# EasyEDA Pro project ProPrj_立创开发板3.1寸MIPI屏幕扩展板.epro

# Schematic 原理图

## Sheets
1 P1: Board Name: Board1; Create Date: 2024-09-23; Page Name: P1; Project Name: 立创开发板3.1寸屏幕扩展板V0.0.2; Schematic Name: Schematic1; Update Date: 2024-09-23
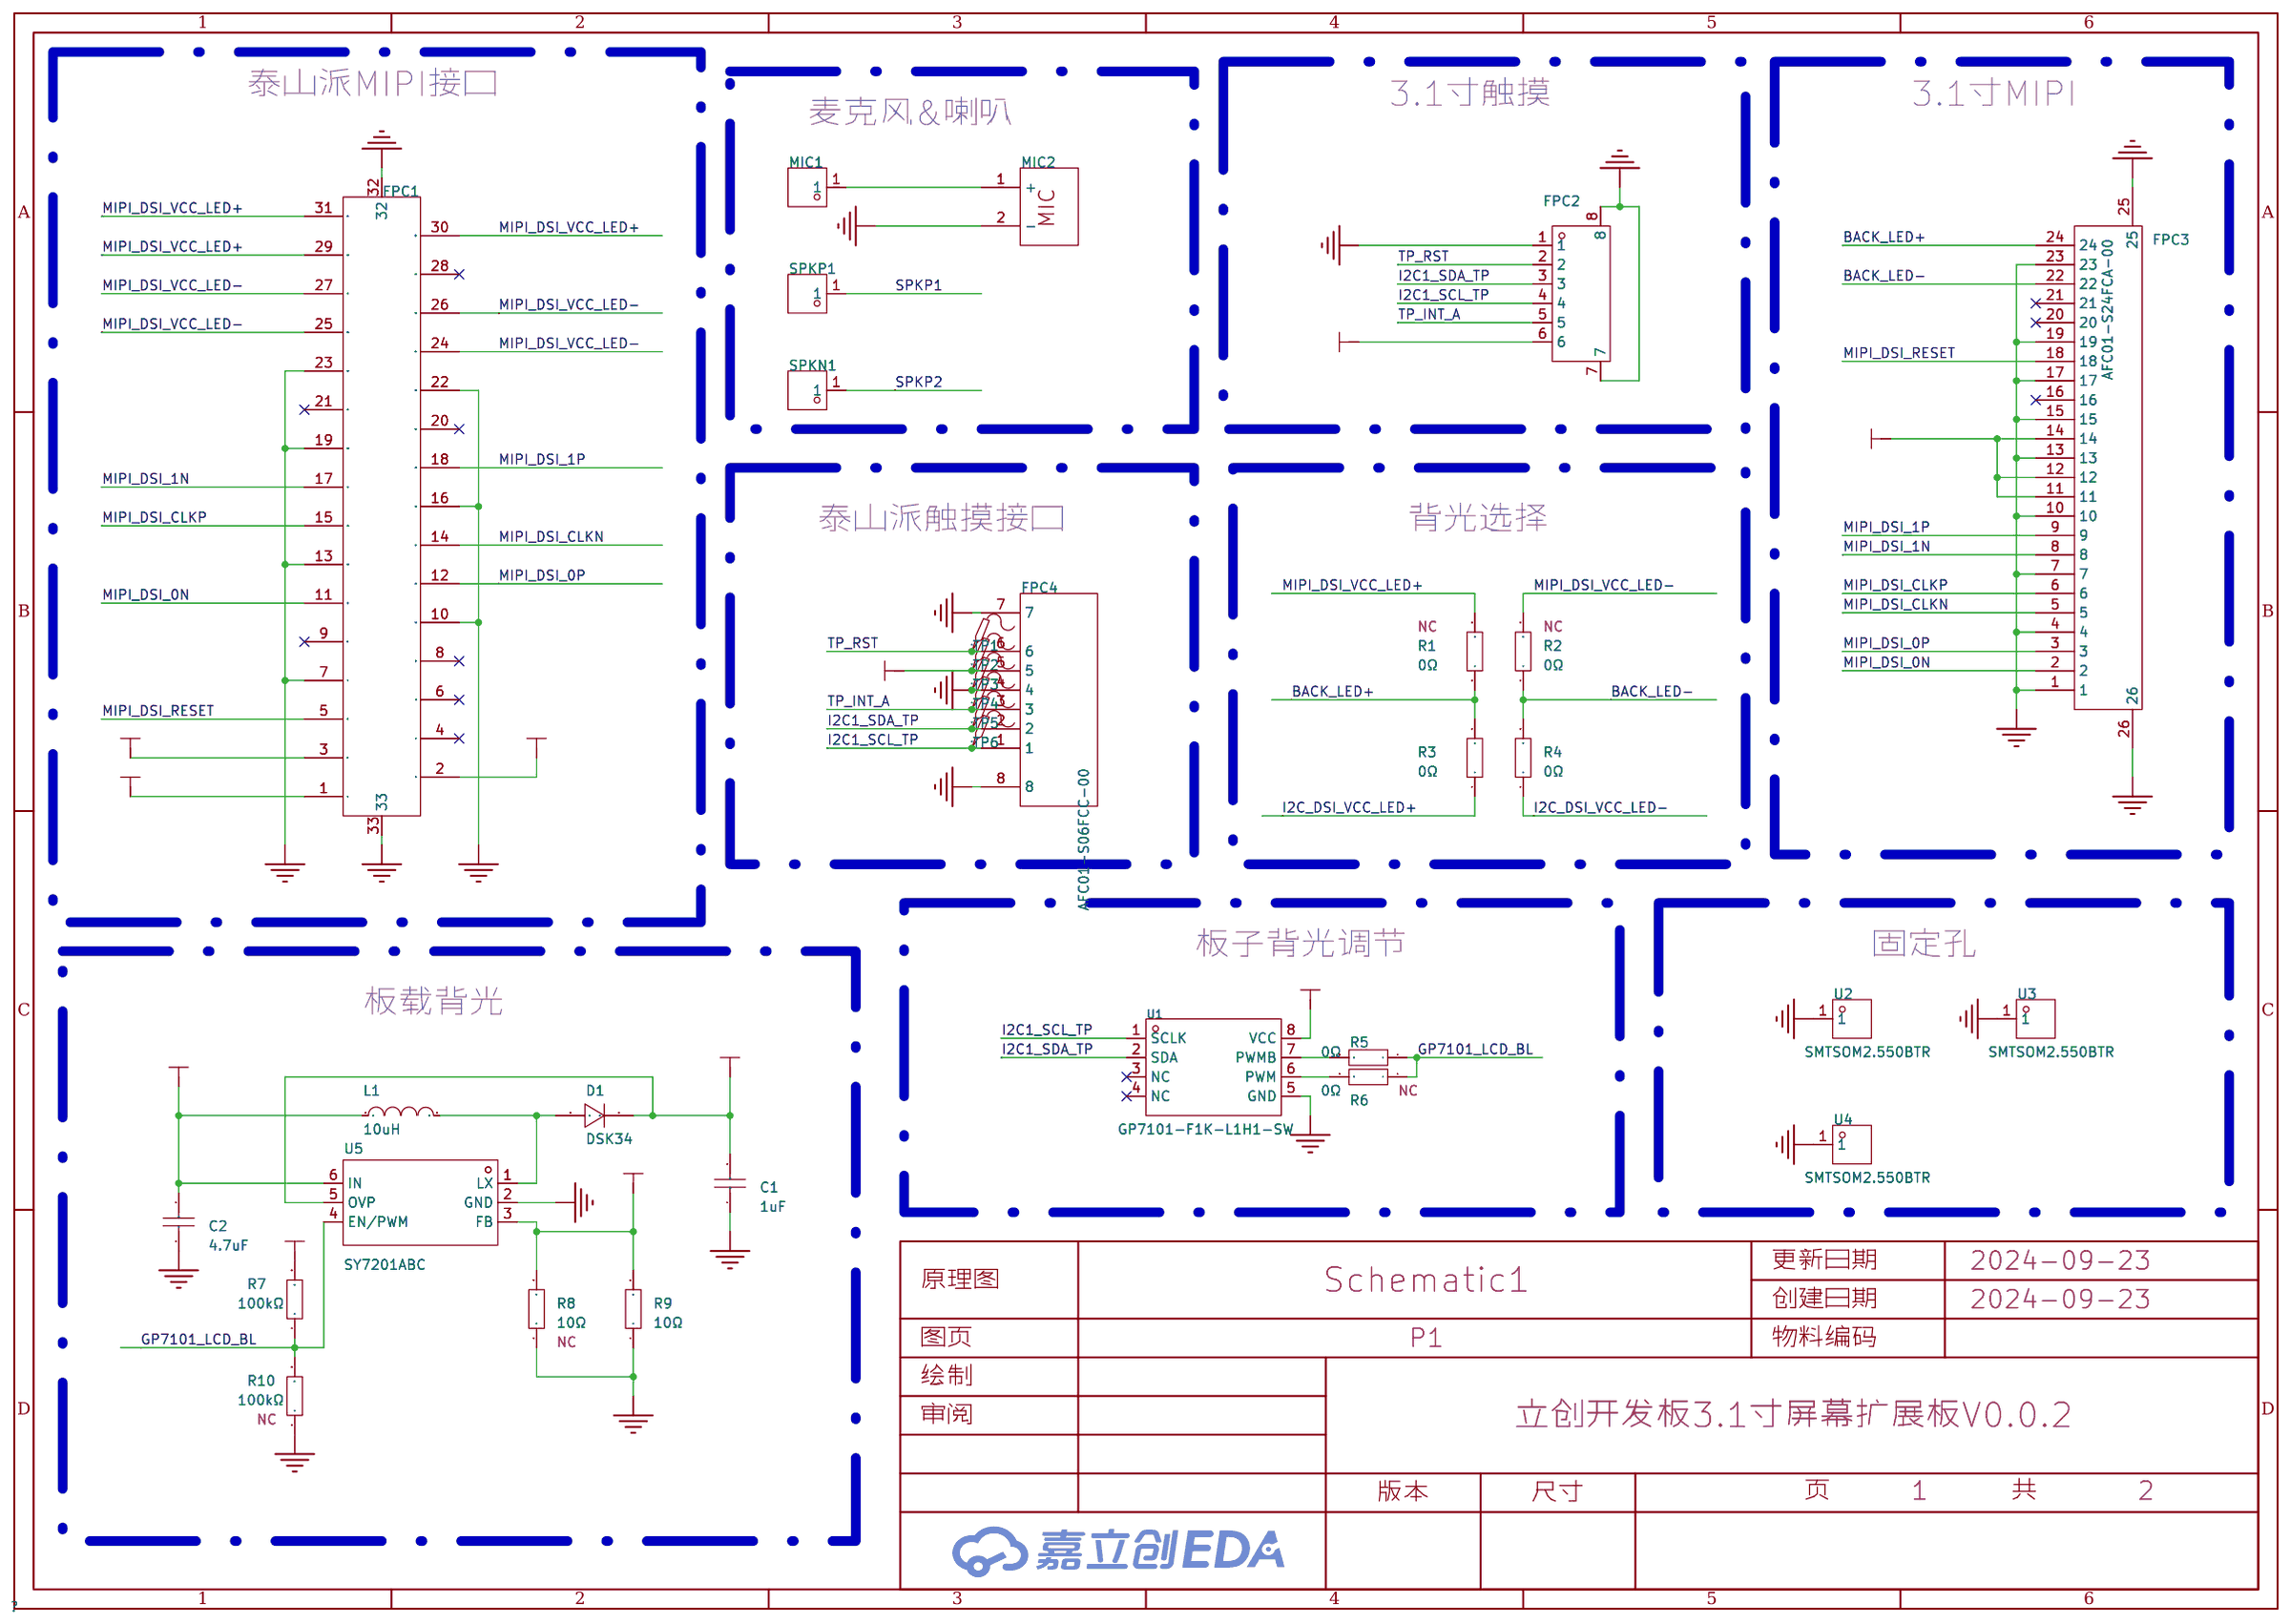
[diagram p0: P1]
2 P2: Create Date: 2024-09-14; Page Name: P2; Project Name: 立创开发板3.1寸屏幕扩展板; Update Date: 2024-09-19
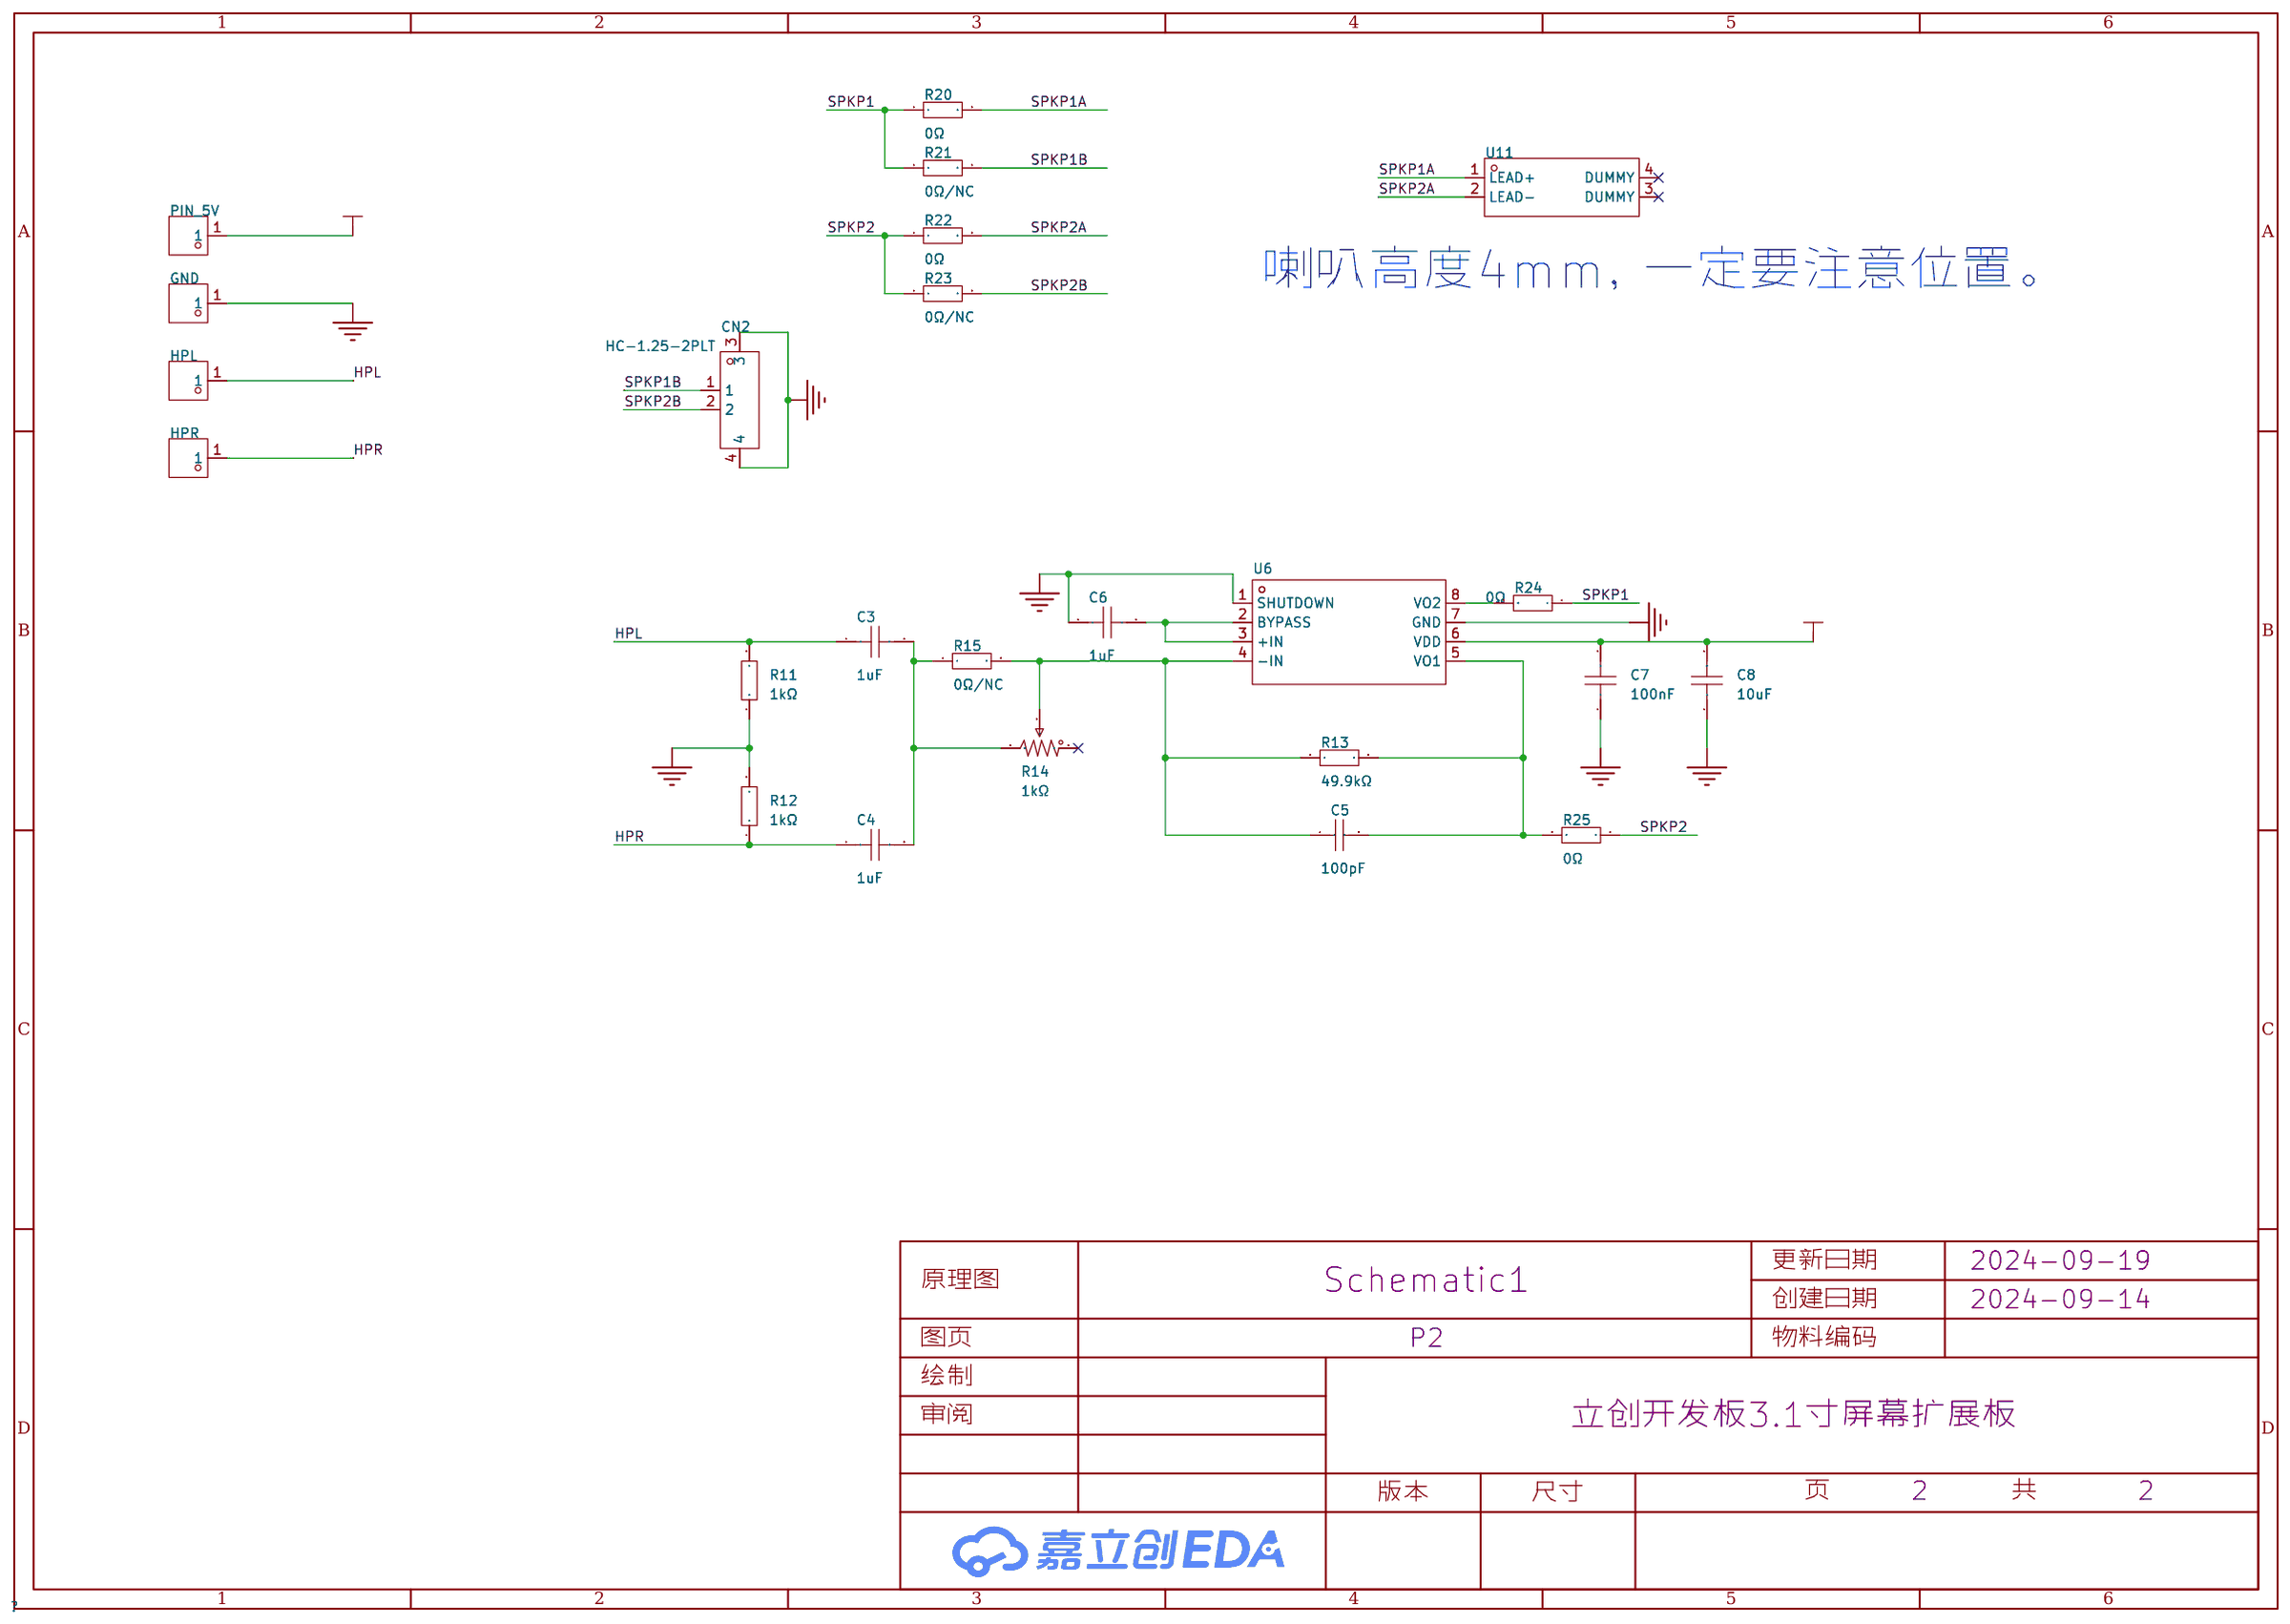
[diagram p1: P2]

## Parts
sheet P1
C1  1uF  [R0805]
C2  4.7uF  [R0805]
D1  DSK34  [SOD-123FL_L2.7-W1.8-LS3.8-RD]
FPC1  AFE03-S31FMA-1H  [FPC-SMD_P0.30-31P_FGS-XJ-H1.0]
FPC2  FPC-05F-6PH20  [FPC-SMD_6P-P0.50_XUNPU_FPC-05F-6PH20]
FPC3  AFC01-S24FCA-00  [FPC-SMD_P0.50-24P_FGS-XJ-H2.0]
FPC4  AFC01-S06FCC-00  [FPC-SMD_AFC01-S06FCC-00]
L1  10uH  [IND-SMD_L2.5-W2.0_WPN252012H]
MIC1  YTC1P-3010-01  [TESTPOINT-SMD_BD2.0_C9900030651]
MIC2  B4013AM423-008  [MIC-SMD_BD4.0_B4013AM423-008]
R1  0Ω  [R0805]
R2  0Ω  [R0805]
R3  0Ω  [R0805]
R4  0Ω  [R0805]
R5  0Ω  [R0805]
R6  0Ω  [R0805]
R7  100kΩ  [R0805]
R8  10Ω  [R0805_NEW]
R9  10Ω  [R0805_NEW]
R10  100kΩ  [R0805]
SPKN1  YTC1P-3010-01  [TESTPOINT-SMD_BD2.0_C9900030651]
SPKP1  YTC1P-3010-01  [TESTPOINT-SMD_BD2.0_C9900030651]
TP1  -  [Test-Point-0.5mm]
TP2  -  [Test-Point-0.5mm]
TP3  -  [Test-Point-0.5mm]
TP4  -  [Test-Point-0.5mm]
TP5  -  [Test-Point-0.5mm]
TP6  -  [Test-Point-0.5mm]
U1  GP7101-F1K-L1H1-SW  [SOIC-8_L4.9-W3.9-P1.27-LS6.0-BL]
U2  SMTSOM2.550BTR  [SMD_BD5.6-D4.1]
U3  SMTSOM2.550BTR  [SMD_BD5.6-D4.1]
U4  SMTSOM2.550BTR  [SMD_BD5.6-D4.1]
U5  SY7201ABC  [SOT-23-6_L2.9-W1.6-P0.95-LS2.8-BR]
sheet P2
C3  1uF  [C0603]
C4  1uF  [C0603]
C5  100pF  [C0603]
C6  1uF  [C0603]
C7  100nF  [C0603]
C8  10uF  [C0603]
CN2  HC-1.25-2PLT  [CONN-SMD_HC-1.25-2PLT]
GND  YTC1P-3010-01  [TESTPOINT-SMD_BD2.0_C9900030651]
HPL  YTC1P-3010-01  [TESTPOINT-SMD_BD2.0_C9900030651]
HPR  YTC1P-3010-01  [TESTPOINT-SMD_BD2.0_C9900030651]
PIN_5V  YTC1P-3010-01  [TESTPOINT-SMD_BD2.0_C9900030651]
R11  1kΩ  [R0603]
R12  1kΩ  [R0603]
R13  49.9kΩ  [R0603]
R14  1kΩ  [RES-ADJ-SMD_3P-L3.8-W3.6-P1.90-BL]
R15  0Ω/NC  [R0603]
R20  0Ω  [R0603]
R21  0Ω/NC  [R0603]
R22  0Ω  [R0603]
R23  0Ω/NC  [R0603]
R24  0Ω  [R0805]
R25  0Ω  [R0805]
U6  SC8002B  [SOP-8_L4.9-W3.9-P1.27-LS6.0-BL]
U11  KLJ-01304T-08R07W  [BUZ-SMD_4P-L13.0-W13.0-P11.4-BL]

## Library data of the parts
C1 = CL21B105KBFNNNE: 容值:1uF;精度:±10%;额定电压:50V;材质(温度系数):X7R;; LCSC Part Name: 1uF ±10% 50V; Supplier Part: C28323; Manufacturer: SAMSUNG(三星); Supplier Footprint: 0805; JLCPCB Part Class: 基础库; Datasheet: https://atta.szlcsc.com/upload/public/pdf/source/20160218/1457707763339.pdf; Supplier: LCSC; Tolerance: ±10%; Voltage Rated: 50V; Temperature Coefficient: X7R
C2 = CL21A475KAQNNNE: 容值:4.7uF;精度:±10%;额定电压:25V;材质(温度系数):X5R;; LCSC Part Name: 4.7uF ±10% 25V; Supplier Part: C1779; Manufacturer: SAMSUNG(三星); Supplier Footprint: 0805; JLCPCB Part Class: 基础库; Datasheet: https://atta.szlcsc.com/upload/public/pdf/source/20160218/1457707763339.pdf; Supplier: LCSC; Tolerance: ±10%; Voltage Rated: 25V; Temperature Coefficient: X5R
D1 = DSK34_C727076: 二极管配置:-;直流反向耐压(Vr):1kV;平均整流电流(Io):1A;正向压降(Vf):1.1V@1A;反向电流(Ir):10uA@1kV;; Supplier Part: C727076; Manufacturer: TWGMC(台湾迪嘉); Supplier Footprint: SOD-123FL; JLCPCB Part Class: Extended Part; Datasheet: https://atta.szlcsc.com/upload/public/pdf/source/20200828/C727076_B37FCA1E25E95F22A97D5A5D18D72E25.pdf; Supplier: LCSC; Reverse Voltage (Vr): 1kV; Average Rectified Current (Io): 1A; Forward Voltage (Vf@If): 1.1V@1A; Reverse Leakage Current: 10uA@1kV
FPC1 = AFE03-S31FMA-1H: 间距:0.3mm;触点数量:31;锁定特性:翻盖式;安装类型:卧贴;触点类型:下接;; LCSC Part Name: FPC 0.3 MM 31P 翻盖式 H1.0mm 下接; Supplier Part: C262545; Manufacturer: JS(钜硕电子); Supplier Footprint: P=0.3mm; JLCPCB Part Class: Extended Part; Datasheet: https://atta.szlcsc.com/upload/public/pdf/source/20180810/C262545_77B457498850318D655D6A9CA7AC22AD.pdf; Supplier: LCSC; Locking Feature: 翻盖式; Contact Type: 下接; Number of Contacts: 31; Pitch: 0.3mm; Mounting Type: 卧贴; FFC, FCB Thickness: 0.2mm~0.2mm; Height Above Board: 1mm
FPC2 = FPC-05F-6PH20: 间距:0.5mm;触点数量:6P;锁定特性:翻盖式;触点类型:下接;安装类型:卧贴;工作温度范围:-25℃~+85℃;; LCSC Part Name: 间距:0.5mm P数:6P 翻盖式 下接; Supplier Part: C2856796; Manufacturer: XUNPU(讯普); Supplier Footprint: SMD,P=0.5mm,卧贴; JLCPCB Part Class: 扩展库; Datasheet: https://atta.szlcsc.com/upload/public/pdf/source/20210922/16B003FB53336DDF6538142CC465AC4D.pdf; Supplier: LCSC; Pitch: 0.5mm; Number of Contacts: 6P; Locking Feature: 翻盖式; FFC, FCB Thickness: 0.3mm; Contact Type: 下接; Mounting Type: 卧贴; Height Above Board: 2mm; Operating Temperature Range: -25℃~+85℃
FPC3 = AFC01-S24FCA-00: 间距:0.5mm;触点数量:24P;锁定特性:翻盖式;触点类型:下接;安装类型:卧贴;; LCSC Part Name: 间距:0.5mm P数:24P 翻盖式 下接; Supplier Part: C262669; Manufacturer: JS(钜硕电子); Supplier Footprint: SMD,P=0.5mm,卧贴; JLCPCB Part Class: 扩展库; Datasheet: https://atta.szlcsc.com/upload/public/pdf/source/20190816/C413942_2A72D1AC756EAE17EEDF756A339D4500.pdf; Supplier: LCSC; Pitch: 0.5mm; Number of Contacts: 24P; Locking Feature: 翻盖式; FFC, FCB Thickness: 0.3mm; Contact Type: 下接; Mounting Type: 卧贴; Height Above Board: 2mm
FPC4 = AFC01-S06FCC-00: 间距:0.5mm;触点数量:6;锁定特性:翻盖式;安装类型:卧贴;触点类型:下接;; LCSC Part Name: 0.5mm翻盖6P; Supplier Part: C262262; Manufacturer: JS(钜硕电子); Supplier Footprint: P=0.5mm; JLCPCB Part Class: Extended Part; Datasheet: https://atta.szlcsc.com/upload/public/pdf/source/20180810/C262262_206E24848442025CB909F073CC69569A.pdf; Supplier: LCSC; Pitch: 0.5mm; Number of Contacts: 6; Locking Feature: 翻盖式; Mounting Type: 卧贴; Contact Type: 下接; Height Above Board: 2mm; FFC, FCB Thickness: 0.3mm~0.3mm
L1 = WPN252012H100MT: 电感值:10uH;精度:±20%;额定电流:850mA;直流电阻(DCR):480mΩ;; LCSC Part Name: 10uH ±20% 850mA 480mΩ; Supplier Part: C98353; Manufacturer: Sunlord(顺络); Supplier Footprint: SMD; JLCPCB Part Class: Extended Part; Datasheet: https://atta.szlcsc.com/upload/public/pdf/source/20210916/5D33DED32780FEB7D0AA8BED8FC93477.pdf; Supplier: LCSC; Tolerance: ±20%; Rated Current: 850mA; DC Resistance (DCR): 480mΩ; Saturation Current (Isat): 110mA; Frequency - Self Resonant: 2MHz
GND HPL HPR MIC1 PIN_5V SPKN1 SPKP1 = YTC1P-3010-01: 类型:弹簧顶针(POGO PIN);PIN位数:单PIN位;全长/全高:4mm;额定电流:2.5A;额定电压:12V;触头材质:黄铜;触头镀层:金;; LCSC Part Name: POGO PIN弹簧顶针 贴片连接器; Supplier Part: C5221282; Manufacturer: YIYUAN(怡远); JLCPCB Part Class: 扩展库; Datasheet: https://atta.szlcsc.com/upload/public/pdf/source/20221031/BD070516233C1C93A35D01CFB419D0D5.pdf; Supplier: LCSC; Type: 弹簧顶针(POGO PIN); Number of Pins: 单PIN位; Overall Length/Height: 4mm; Rated Current: 2.5A; Rated Voltage: 12V; Contact Material: 黄铜; Contact Plating: 金
MIC2 = B4013AM423-008: LCSC Part Name: 驻极体电容φ4.0*1.3mm 1.0V-10V 灵敏度-42dB; Supplier Part: C233794; Manufacturer: Goertek(歌尔); JLCPCB Part Class: 扩展库; Datasheet: https://atta.szlcsc.com/upload/public/pdf/source/20180813/C233794_264218F4B1A78DA959E94BA30E23E4FF.pdf; Supplier: LCSC
R1 R2 R6 = 0805W8F0000T5E: 电阻类型:厚膜电阻;阻值:0Ω;精度:±1%;功率:125mW;最大工作电压:150V;温度系数:±800ppm/℃;; LCSC Part Name: 0Ω ±1% 125mW 厚膜电阻; Supplier Part: NC; Manufacturer: UNI-ROYAL(厚声); Supplier Footprint: 0805; JLCPCB Part Class: 基础库; Datasheet: https://atta.szlcsc.com/upload/public/pdf/source/20200306/C422600_1E6D84923E4A46A82E41ADD87F860B5C.pdf; Supplier: LCSC; Type: 厚膜电阻; Tolerance: ±1%; Power(Watts): 125mW; Overload Voltage (Max): 150V; Temperature Coefficient: ±800ppm/℃; Operating Temperature Range: -55℃~+155℃
R3-R5 R24 R25 = 0805W8F0000T5E: 电阻类型:厚膜电阻;阻值:0Ω;精度:±1%;功率:125mW;最大工作电压:150V;温度系数:±800ppm/℃;; LCSC Part Name: 0Ω ±1% 125mW 厚膜电阻; Supplier Part: C17477; Manufacturer: UNI-ROYAL(厚声); Supplier Footprint: 0805; JLCPCB Part Class: 基础库; Datasheet: https://atta.szlcsc.com/upload/public/pdf/source/20200306/C422600_1E6D84923E4A46A82E41ADD87F860B5C.pdf; Supplier: LCSC; Type: 厚膜电阻; Tolerance: ±1%; Power(Watts): 125mW; Overload Voltage (Max): 150V; Temperature Coefficient: ±800ppm/℃; Operating Temperature Range: -55℃~+155℃
R7 = 0805W8F1003T5E: 电阻类型:厚膜电阻;阻值:100kΩ;精度:±1%;功率:125mW;最大工作电压:150V;温度系数:±100ppm/℃;; LCSC Part Name: 100kΩ ±1% 125mW 厚膜电阻; Supplier Part: C149504; Manufacturer: UNI-ROYAL(厚声); Supplier Footprint: 0805; JLCPCB Part Class: 基础库; Datasheet: https://atta.szlcsc.com/upload/public/pdf/source/20200306/C422600_1E6D84923E4A46A82E41ADD87F860B5C.pdf; Supplier: LCSC; Type: 厚膜电阻; Tolerance: ±1%; Power(Watts): 125mW; Overload Voltage (Max): 150V; Temperature Coefficient: ±100ppm/℃; Operating Temperature Range: -55℃~+155℃
R8 = 0805W8F100JT5E: 电阻类型:厚膜电阻;阻值:10Ω;精度:±1%;功率:125mW;最大工作电压:150V;温度系数:±200ppm/℃;; LCSC Part Name: 10Ω ±1% 125mW 厚膜电阻; Supplier Part: NC; Manufacturer: UNI-ROYAL(厚声); Supplier Footprint: 0805; JLCPCB Part Class: 基础库; Datasheet: https://atta.szlcsc.com/upload/public/pdf/source/20200306/C422600_1E6D84923E4A46A82E41ADD87F860B5C.pdf; Supplier: LCSC; Type: 厚膜电阻; Tolerance: ±1%; Power(Watts): 125mW; Overload Voltage (Max): 150V; Temperature Coefficient: ±200ppm/℃; Operating Temperature Range: -55℃~+155℃
R9 = 0805W8F100JT5E: 电阻类型:厚膜电阻;阻值:10Ω;精度:±1%;功率:125mW;最大工作电压:150V;温度系数:±200ppm/℃;; LCSC Part Name: 10Ω ±1% 125mW 厚膜电阻; Supplier Part: C17415; Manufacturer: UNI-ROYAL(厚声); Supplier Footprint: 0805; JLCPCB Part Class: 基础库; Datasheet: https://atta.szlcsc.com/upload/public/pdf/source/20200306/C422600_1E6D84923E4A46A82E41ADD87F860B5C.pdf; Supplier: LCSC; Type: 厚膜电阻; Tolerance: ±1%; Power(Watts): 125mW; Overload Voltage (Max): 150V; Temperature Coefficient: ±200ppm/℃; Operating Temperature Range: -55℃~+155℃
R10 = 0805W8F1003T5E: 电阻类型:厚膜电阻;阻值:100kΩ;精度:±1%;功率:125mW;最大工作电压:150V;温度系数:±100ppm/℃;; LCSC Part Name: 100kΩ ±1% 125mW 厚膜电阻; Supplier Part: NC; Manufacturer: UNI-ROYAL(厚声); Supplier Footprint: 0805; JLCPCB Part Class: 基础库; Datasheet: https://atta.szlcsc.com/upload/public/pdf/source/20200306/C422600_1E6D84923E4A46A82E41ADD87F860B5C.pdf; Supplier: LCSC; Type: 厚膜电阻; Tolerance: ±1%; Power(Watts): 125mW; Overload Voltage (Max): 150V; Temperature Coefficient: ±100ppm/℃; Operating Temperature Range: -55℃~+155℃
TP1-TP6 = Test-Point: Test Point 测试点
U1 = GP7101-F1K-L1H1-SW: 数模转换芯片ADC@@通过I2C进行数据输入，线性转换成0%-100%占空比的PWM信号输出; Supplier Part: C7471834; Manufacturer: Guestgood(客益); Supplier Footprint: SOP-8; Datasheet: https://atta.szlcsc.com/upload/public/pdf/source/20231229/76062E2A220BC0161533915FA1180BFB.pdf; Supplier: LCSC
U2-U4 = SMTSOM2.550BTR: M2x4.35xL5+1.4; LCSC Part Name: M2.5 贴片螺母 L=5mm铜镀锡; Supplier Part: C5301778; Manufacturer: YIYUAN(怡远); Supplier Footprint: M2.5; JLCPCB Part Class: Extended Part; Datasheet: https://atta.szlcsc.com/upload/public/pdf/source/20230202/A42D22DA7D93D728E13784C4003E4077.pdf; Supplier: LCSC; specifications: M2.5; surface treatment: 镀锡; material quality: 铜; length: 5mm; model: SMTWE2050MTJ; brand: Sinhoo(雄和远景)
U5 = SY7201ABC: 30V 大电流LED驱动IC; Supplier Part: C82173; Manufacturer: silergy(矽力杰); Supplier Footprint: SOT-23-6; JLCPCB Part Class: Extended Part; Datasheet: https://atta.szlcsc.com/upload/public/pdf/source/20160903/1472896628181.pdf; Supplier: LCSC
C3 C4 C6 = CL10A105KB8NNNC: 容值:1uF;精度:±10%;额定电压:50V;材质(温度系数):X5R;; LCSC Part Name: 1uF ±10% 50V; Supplier Part: C15849; Manufacturer: SAMSUNG(三星); Supplier Footprint: 0603; JLCPCB Part Class: 基础库; Datasheet: https://atta.szlcsc.com/upload/public/pdf/source/20160218/1457707763339.pdf; Supplier: LCSC; Tolerance: ±10%; Voltage Rated: 50V; Temperature Coefficient: X5R
C5 = CL10C101JB8NNNC: 容值:100pF;精度:±5%;额定电压:50V;材质(温度系数):C0G;; LCSC Part Name: 100pF ±5% 50V; Supplier Part: C14858; Manufacturer: SAMSUNG(三星); Supplier Footprint: 0603; JLCPCB Part Class: 基础库; Datasheet: https://atta.szlcsc.com/upload/public/pdf/source/20160218/1457707763339.pdf; Supplier: LCSC; Tolerance: ±5%; Voltage Rated: 50V; Temperature Coefficient: C0G
C7 = CC0603KRX7R9BB104: 容值:100nF;精度:±10%;额定电压:50V;材质(温度系数):X7R;; LCSC Part Name: 100nF ±10% 50V; Supplier Part: C14663; Manufacturer: YAGEO(国巨); Supplier Footprint: 0603; JLCPCB Part Class: 基础库; Datasheet: https://atta.szlcsc.com/upload/public/pdf/source/20180910/C282072_33301C7F631E79921B82A8DAC6BCC5B3.pdf; Supplier: LCSC; Tolerance: ±10%; Voltage Rated: 50V; Temperature Coefficient: X7R
C8 = CL10A106MA8NRNC: 容值:10uF;精度:±20%;额定电压:25V;材质(温度系数):X5R;; LCSC Part Name: 10uF ±20% 25V; Supplier Part: C96446; Manufacturer: SAMSUNG(三星); Supplier Footprint: 0603; JLCPCB Part Class: 基础库; Datasheet: https://atta.szlcsc.com/upload/public/pdf/source/20160218/1457707763339.pdf; Supplier: LCSC; Tolerance: ±20%; Voltage Rated: 25V; Temperature Coefficient: X5R
CN2 = HC-1.25-2PLT: 插针结构:1x2P;间距:1.25mm;安装方式:立贴;参考系列:-;总PIN数:2P;排数:1;每排PIN数:2;行距:-;额定电流:2A;触头材质:黄铜;触头镀层:锡;工作温度范围:-25℃~+85℃;; LCSC Part Name: 1x2P 间距:1.25mm 立贴; Supplier Part: C2845388; Manufacturer: HCTL(华灿天禄); Supplier Footprint: SMD,P=1.25mm; JLCPCB Part Class: 扩展库; Datasheet: https://atta.szlcsc.com/upload/public/pdf/source/20230707/8E5913B5A3195C18F5EE12EA4CB86B82.pdf; Supplier: LCSC; Pins Structure: 1x2P; Pitch: 1.25mm; Mounting Style: 立贴; Number of Pins: 2P; Number of Rows: 1; Number of PINs Per Row: 2; Current Rating (Max): 2A; Contact Material: 黄铜; Contact Plating: 锡; Operating Temperature Range: -25℃~+85℃
R11 R12 = 0603WAF1001T5E: 电阻类型:厚膜电阻;阻值:1kΩ;精度:±1%;功率:100mW;最大工作电压:75V;温度系数:±100ppm/℃;; LCSC Part Name: 1kΩ ±1% 100mW 厚膜电阻; Supplier Part: C21190; Manufacturer: UNI-ROYAL(厚声); Supplier Footprint: 0603; JLCPCB Part Class: 基础库; Datasheet: https://atta.szlcsc.com/upload/public/pdf/source/20200306/C422600_1E6D84923E4A46A82E41ADD87F860B5C.pdf; Supplier: LCSC; Type: 厚膜电阻; Tolerance: ±1%; Power(Watts): 100mW; Overload Voltage (Max): 75V; Temperature Coefficient: ±100ppm/℃; Operating Temperature Range: -55℃~+155℃
R13 = 0603WAF4992T5E: 电阻类型:厚膜电阻;阻值:49.9kΩ;精度:±1%;功率:100mW;最大工作电压:75V;温度系数:±100ppm/℃;; LCSC Part Name: 49.9kΩ ±1% 100mW 厚膜电阻; Supplier Part: C23184; Manufacturer: UNI-ROYAL(厚声); Supplier Footprint: 0603; JLCPCB Part Class: 基础库; Datasheet: https://atta.szlcsc.com/upload/public/pdf/source/20200306/C422600_1E6D84923E4A46A82E41ADD87F860B5C.pdf; Supplier: LCSC; Type: 厚膜电阻; Tolerance: ±1%; Power(Watts): 100mW; Overload Voltage (Max): 75V; Temperature Coefficient: ±100ppm/℃; Operating Temperature Range: -55℃~+155℃
R14 = TC33X-2-102E: 阻值:1kΩ;精度:±25%;功率:150mW;温度系数:±250ppm/℃;; LCSC Part Name: 1kΩ ±25%; Supplier Part: C719174; Manufacturer: BOURNS; Supplier Footprint: SMD-3P,3.8x3.6mm; JLCPCB Part Class: 扩展库; Datasheet: https://atta.szlcsc.com/upload/public/pdf/source/20200810/C720646_BB66A75E654D5E1D30127FF45BCD3C26.pdf; Supplier: LCSC; Tolerance: ±25%; Power(Watts): 150mW; Temperature Coefficient: ±250ppm/℃; Turns: 1
R15 R21 R23 = 0603WAF0000T5E: 电阻类型:厚膜电阻;阻值:0Ω;精度:±1%;功率:100mW;最大工作电压:75V;; LCSC Part Name: 0Ω ±1% 100mW 厚膜电阻; Supplier Part: C21189; Manufacturer: UNI-ROYAL(厚声); Supplier Footprint: 0603; JLCPCB Part Class: 基础库; Datasheet: https://atta.szlcsc.com/upload/public/pdf/source/20200306/C422600_1E6D84923E4A46A82E41ADD87F860B5C.pdf; Supplier: LCSC; Type: 厚膜电阻; Tolerance: ±1%; Power(Watts): 100mW; Overload Voltage (Max): 75V; Operating Temperature Range: -55℃~+155℃
R20 R22 = 0603WAF0000T5E: 电阻类型:厚膜电阻;阻值:0Ω;精度:±1%;功率:100mW;最大工作电压:75V;; LCSC Part Name: 0Ω ±1% 100mW 厚膜电阻; Supplier Part: C21189; Manufacturer: UNI-ROYAL(厚声); Supplier Footprint: 0603; JLCPCB Part Class: Basic Part; Datasheet: https://atta.szlcsc.com/upload/public/pdf/source/20200306/C422600_1E6D84923E4A46A82E41ADD87F860B5C.pdf; Supplier: LCSC; Type: 厚膜电阻; Tolerance: ±1%; Power(Watts): 100mW; Overload Voltage (Max): 75V; Operating Temperature Range: -55℃~+155℃
U6 = SC8002B: 功放类型:-;扬声器通道数:单声道;输出功率:2.5Wx1@4Ω;; Supplier Part: C82124; Manufacturer: FM(富满); Supplier Footprint: SOP-8; JLCPCB Part Class: 扩展库; Datasheet: https://atta.szlcsc.com/upload/public/pdf/source/20180404/C82124_A098B0D41B54F1DA43A0B2949153E019.pdf; Supplier: LCSC; Speaker Channels: 单声道; Output Power: 2.5Wx1@4Ω; Supply Voltage: 2V~5V
U11 = KLJ-01304T-08R07W: 产品一致性好、抗老化能力强; LCSC Part Name: 贴片扬声器; Supplier Part: C18186315; Manufacturer: KELIKING(凯丽金); Supplier Footprint: SMD; JLCPCB Part Class: 扩展库; Datasheet: https://atta.szlcsc.com/upload/public/pdf/source/20230919/C678367A6B20E4B0D074A72F75ACAB7B.pdf; Supplier: LCSC

## Nets
GND: C1.1 C2.1 C6.1 C7.1 C8.1 CN2.3 CN2.4 FPC1.7 FPC1.10 FPC1.13 FPC1.16 FPC1.19 FPC1.22 FPC1.23 FPC1.32 FPC1.33 FPC2.1 FPC2.7 FPC2.8 FPC3.1 FPC3.4 FPC3.7 FPC3.10 FPC3.13 FPC3.15 FPC3.17 FPC3.19 FPC3.23 FPC3.25 FPC3.26 FPC4.4 FPC4.7 FPC4.8 GND.1 MIC2.2(-) R8.1 R9.1 R10.1 R11.1 R12.2 TP3.1 U1.5(GND) U2.1 U3.1 U4.1 U5.2(GND) U6.1(SHUTDOWN) U6.7(GND)
VCC_3V3: C2.2 FPC1.1 FPC1.2 FPC1.3 FPC2.6 FPC3.11 FPC3.12 FPC3.14 FPC4.5 L1.1 R7.2 TP2.1 U1.8(VCC) U5.6(IN)
BACK_LED+: FPC3.24 R1.1 R3.2
BACK_LED-: FPC3.22 R2.1 R4.2
GP7101_LCD_BL: R5.1 R6.1 R7.1 R10.2 U5.4(EN/PWM)
HPL: C3.1 HPL.1 R11.2
HPR: C4.1 HPR.1 R12.1
I2C1_SCL_TP: FPC2.4 FPC4.1 TP6.1 U1.1(SCLK)
I2C1_SDA_TP: FPC2.3 FPC4.2 TP5.1 U1.2(SDA)
I2C_DSI_VCC_LED+: C1.2 D1.1(C) R3.1 U5.5(OVP)
I2C_DSI_VCC_LED-: R4.1 R8.2 R9.2 U5.3(FB)
MIPI_DSI_0N: FPC1.11 FPC3.2
MIPI_DSI_0P: FPC1.12 FPC3.3
MIPI_DSI_1N: FPC1.17 FPC3.8
MIPI_DSI_1P: FPC1.18 FPC3.9
MIPI_DSI_CLKN: FPC1.14 FPC3.5
MIPI_DSI_CLKP: FPC1.15 FPC3.6
MIPI_DSI_RESET: FPC1.5 FPC3.18
MIPI_DSI_VCC_LED+: FPC1.29 FPC1.30 FPC1.31 R1.2
MIPI_DSI_VCC_LED-: FPC1.24 FPC1.25 FPC1.26 FPC1.27 R2.2
PIN_5V: C7.2 C8.2 PIN_5V.1 U6.6(VDD)
SPKP1: R20.1 R21.1 R24.1 SPKP1.1
SPKP1A: R20.2 U11.1(LEAD+)
SPKP1B: CN2.1 R21.2
SPKP2: R22.1 R23.1 R25.1 SPKN1.1
SPKP2A: R22.2 U11.2(LEAD-)
SPKP2B: CN2.2 R23.2
TP_INT_A: FPC2.5 FPC4.3 TP4.1
TP_RST: FPC2.2 FPC4.6 TP1.1
$1N1316: D1.2(A) L1.2 U5.1(LX)
$1N3740: MIC1.1 MIC2.1(+)
$1N14217: R6.2 U1.6(PWM)
$1N14397: R5.2 U1.7(PWMB)
Net-(C3-2): C3.2 C4.2 R14.3 R15.1
Net-(C5-1): C5.1 R13.1 R14.2 R15.2 U6.4(-IN)
Net-(C5-2): C5.2 R13.2 R25.2 U6.5(VO1)
Net-(C6-2): C6.2 U6.2(BYPASS) U6.3(+IN)
Net-(R24-2): R24.2 U6.8(VO2)

Not connected (* = marked no-connect by the designer): FPC1 4* 6* 8* 9* 20* 21* 28*; FPC3 16* 20* 21*; R14 1*; U1 3(NC)* 4(NC)*; U11 3(DUMMY)* 4(DUMMY)*

## Notes on the sheets
sheet 1
- 泰山派MIPI接口
- 3.1寸触摸
- 3.1寸MIPI
- 麦克风&喇叭
- 泰山派触摸接口
- 背光选择
- 板子背光调节
- 固定孔
- 板载背光
sheet 2
- 喇叭高度4mm，一定要注意位置。

# Board PCB
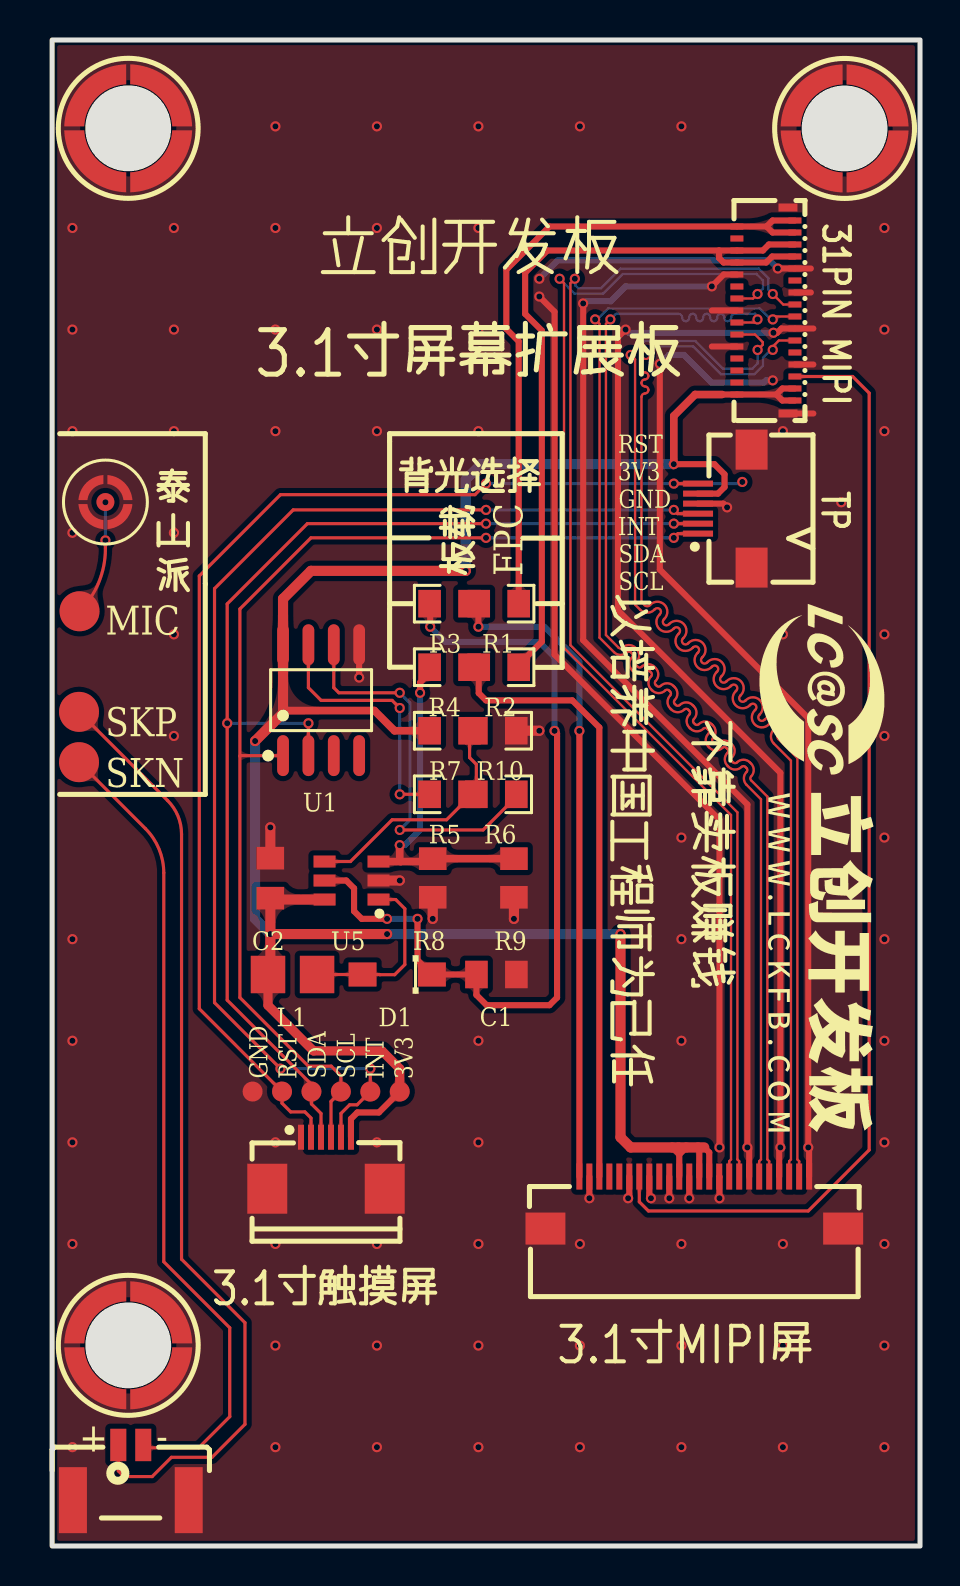
[diagram p2: board, top side]
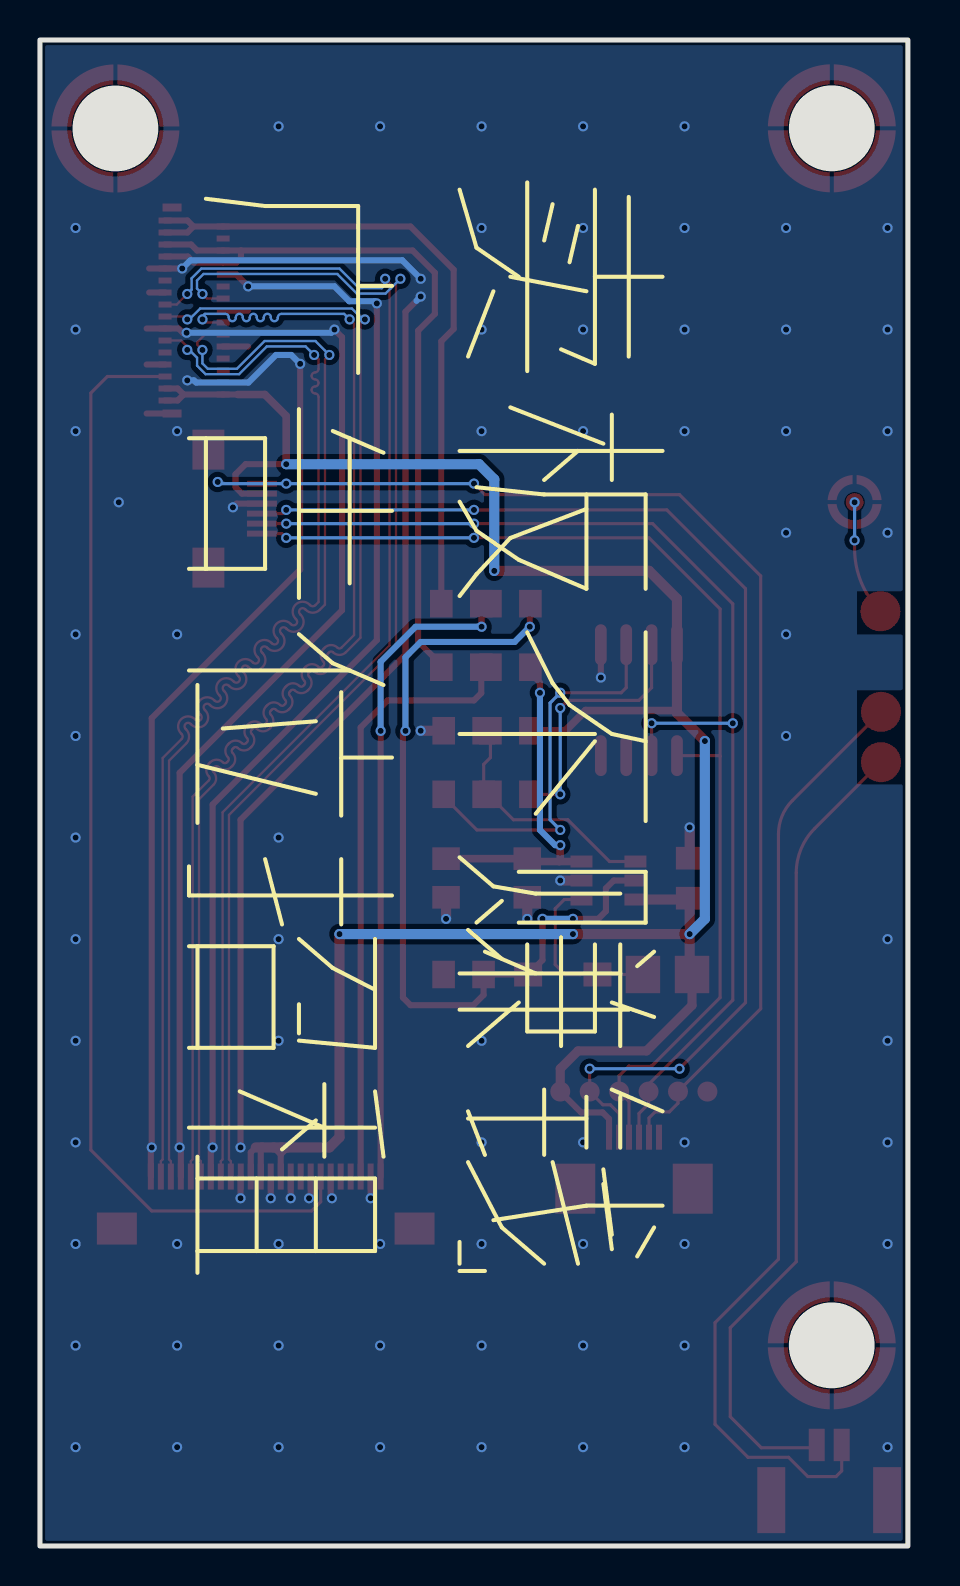
[diagram p3: board, bottom side, seen from below]

Outline 43.44 x 75.3 mm; copper layers: Top Layer, Bottom Layer. Coordinates in mm from the lower left corner of the outline.
Outline path: rectangle 0,75.3 43.44,0
Stack: Top Layer 0.035mm - / Dielectric1 1.51mm FR4 er 4.5 / Bottom Layer 0.035mm -

## Design rules (mm)
net MIPI_DSI_1P: MIPI_DSI, MIPI_DSI_1
net MIPI_DSI_1N: MIPI_DSI, MIPI_DSI_1
net MIPI_DSI_CLKP: MIPI_DSI, MIPI_DSI_CLK
net MIPI_DSI_CLKN: MIPI_DSI, MIPI_DSI_CLK
net MIPI_DSI_0P: MIPI_DSI, MIPI_DSI_0
net MIPI_DSI_0N: MIPI_DSI, MIPI_DSI_0
template: 自定义配置
spacing copperThickness1oz (default): track to track 0.152, other pairs 0 to 0.3
spacing copperThickness2oz: track to track 0.203, other pairs 0.152 to 0.3
track width copperThickness1oz (default): min 0.127, default 0.157, max 0.508
track width pwr: min 0.127, default 0.305, max 2.54
differential pair differentialPair (default): width min 0.117, default 0.117, max 2.54; gap min 0.152, default 0.203
via viaSize (default): diameter min 0.508, default 0.508, max 1.27; hole min 0.305, default 0.305, max 1.27
via viaSize1df: diameter min 0.508, default 0.508, max 0.508; hole min 0.305, default 0.305, max 0.305
net I2C_DSI_VCC_LED- uses pwr
net GND uses pwr
net VCC_3V3 uses pwr
net I2C_DSI_VCC_LED+ uses pwr
net MIPI_DSI_VCC_LED+ uses pwr
net MIPI_DSI_VCC_LED- uses pwr
net BACK_LED+ uses pwr
net BACK_LED- uses pwr

## Placement (name value [footprint] x y rotation side)
C1  1uF  [R0805]  22.24 28.57 180 top
C2  4.7uF  [R0805]  10.92 33.39 270 top
CN2  HC-1.25-2PLT  [CONN-SMD_HC-1.25-2PLT]  3.94 3.67 0 top
D1  DSK34  [SOD-123FL_L2.7-W1.8-LS3.8-RD]  17.27 28.57 180 top
FPC1  AFE03-S31FMA-1H  [FPC-SMD_P0.30-31P_FGS-XJ-H1.0]  35.73 61.77 90 top
FPC2  FPC-05F-6PH20  [FPC-SMD_6P-P0.50_XUNPU_FPC-05F-6PH20]  13.71 19.15 0 top
FPC3  AFC01-S24FCA-00  [FPC-SMD_P0.50-24P_FGS-XJ-H2.0]  32.14 17.17 180 top
FPC4  AFC01-S06FCC-00  [FPC-SMD_AFC01-S06FCC-00]  33.67 51.87 90 top
L1  10uH  [IND-SMD_L2.5-W2.0_WPN252012H]  12.03 28.57 180 top
MIC1  YTC1P-3010-01  [TESTPOINT-SMD_BD2.0_C9900030651]  1.37 46.74 0 top
MIC2  B4013AM423-008  [MIC-SMD_BD4.0_B4013AM423-008]  2.67 52.2 0 top
R1  0Ω  [R0805]  22.35 47.12 0 top
R2  0Ω  [R0805]  22.35 43.94 0 top
R3  0Ω  [R0805]  19.89 47.12 0 top
R4  0Ω  [R0805]  19.89 43.94 0 top
R5  0Ω  [R0805]  19.89 37.58 180 top
R6  0Ω  [R0805]  22.23 37.58 0 top
R7  100kΩ  [R0805]  19.89 40.76 180 top
R8  10Ω  [R0805_NEW]  19.05 33.4 90 top
R9  10Ω  [R0805_NEW]  23.11 33.4 90 top
R10  100kΩ  [R0805]  22.23 40.76 180 top
SPKN1  YTC1P-3010-01  [TESTPOINT-SMD_BD2.0_C9900030651]  1.35 39.19 0 top
SPKP1  YTC1P-3010-01  [TESTPOINT-SMD_BD2.0_C9900030651]  1.35 41.71 0 top
TP1  -  [Test-Point-0.5mm]  11.51 22.72 90 top
TP2  -  [Test-Point-0.5mm]  17.4 22.72 90 top
TP3  -  [Test-Point-0.5mm]  10.03 22.72 90 top
TP4  -  [Test-Point-0.5mm]  15.93 22.72 90 top
TP5  -  [Test-Point-0.5mm]  12.98 22.72 90 top
TP6  -  [Test-Point-0.5mm]  14.45 22.72 90 top
U1  GP7101-F1K-L1H1-SW  [SOIC-8_L4.9-W3.9-P1.27-LS6.0-BL]  13.46 42.29 0 top
U2  SMTSOM2.550BTR  [SMD_BD5.6-D4.1]  3.81 10.03 0 top
U3  SMTSOM2.550BTR  [SMD_BD5.6-D4.1]  3.81 70.88 0 top
U4  SMTSOM2.550BTR  [SMD_BD5.6-D4.1]  39.66 70.88 0 top
U5  SY7201ABC  [SOT-23-6_L2.9-W1.6-P0.95-LS2.8-BR]  14.99 33.27 0 top

## Footprints (pads in the part's own frame, mm; a bottom-side part is the same pattern mirrored in y, then rotated)
CONN-SMD_HC-1.25-2PLT
  rect 0.8x1.62 smd: 1(-0.625,1.38) 2(0.625,1.38)
  rect 1.4x3.3 smd: 3(2.9,-1.38) 4(-2.896,-1.38)
FPC-SMD_6P-P0.50_XUNPU_FPC-05F-6PH20
  rect 0.3x1.25 smd: 1(-1.25,1.288) 2(-0.75,1.288) 3(-0.25,1.288) 4(0.25,1.288) 5(0.75,1.288) 6(1.25,1.288)
  rect 2x2.5 smd: 7(2.94,-1.288) 8(-2.94,-1.288)
FPC-SMD_AFC01-S06FCC-00
  rect 0.3x1.5 smd: 1(-1.25,1.34) 2(-0.75,1.34) 3(-0.251,1.34) 4(0.25,1.34) 5(0.75,1.34) 6(1.251,1.34)
  rect 2x1.6 smd: 7(-2.95,-1.34) 8(2.95,-1.34)
FPC-SMD_P0.30-31P_FGS-XJ-H1.0
  rect 0.3x0.65 smd: 1(-4.5,-1.453) 2(-4.2,1.453) 3(-3.9,-1.453) 4(-3.6,1.453) 5(-3.3,-1.453) 6(-3,1.453) 7(-2.7,-1.453) 8(-2.4,1.453) 9(-2.1,-1.453) 10(-1.8,1.453) 11(-1.5,-1.453) 12(-1.2,1.453) 13(-0.9,-1.453) 14(-0.6,1.453) 15(-0.3,-1.453) 16(0,1.453) 17(0.3,-1.453) 18(0.6,1.453) 19(0.9,-1.453) 20(1.2,1.453) 21(1.5,-1.453) 22(1.8,1.453) 23(2.1,-1.453) 24(2.4,1.453) 25(2.7,-1.453) 26(3,1.453) 27(3.3,-1.453) 28(3.6,1.453) 29(3.9,-1.453) 30(4.2,1.453) 31(4.5,-1.453)
  rect 0.4x0.95 smd: 32(-5.15,-1.103) 33(5.15,-1.103)
FPC-SMD_P0.50-24P_FGS-XJ-H2.0
  rect 0.3x1.3 smd: 1(-5.748,-1.3) 2(-5.248,-1.3) 3(-4.748,-1.3) 4(-4.248,-1.3) 5(-3.748,-1.3) 6(-3.248,-1.3) 7(-2.748,-1.3) 8(-2.248,-1.3) 9(-1.748,-1.3) 10(-1.248,-1.3) 11(-0.748,-1.3) 12(-0.248,-1.3) 13(0.252,-1.3) 14(0.752,-1.3) 15(1.252,-1.3) 16(1.752,-1.3) 17(2.252,-1.3) 18(2.752,-1.3) 19(3.252,-1.3) 20(3.752,-1.3) 21(4.252,-1.3) 22(4.752,-1.3) 23(5.252,-1.3) 24(5.752,-1.3)
  rect 2x1.6 smd: 25(7.45,1.3) 26(-7.45,1.3)
IND-SMD_L2.5-W2.0_WPN252012H
  rect 1.724x1.87 smd: 1(1.228,0) 2(-1.228,0)
MIC-SMD_BD4.0_B4013AM423-008
  round 0.9 smd: 1(0,0)
  custom 1.25x1.25 smd: 2(-0.845,0.725) 2(-0.725,-0.845) 2(0.725,0.845) 2(0.845,-0.725)
R0805
  rect 1.133x1.377 smd: 1(-1,0) 2(1,0)
R0805_NEW
  rect 1.133x1.377 smd: 1(-0.966,0) 2(0.966,0)
SMD_BD5.6-D4.1
  custom 3.1x3.1 smd: 1(-2.102,1.65) 1(-1.65,-2.102) 1(1.65,2.102) 1(2.102,-1.65)
SOD-123FL_L2.7-W1.8-LS3.8-RD
  rect 1.4x1.2 smd: 1(-1.735,0) 2(1.735,0)
SOIC-8_L4.9-W3.9-P1.27-LS6.0-BL
  oval 0.588x2.045 smd: 1(-1.905,-2.772) 2(-0.635,-2.772) 3(0.635,-2.772) 4(1.905,-2.772) 5(1.905,2.772) 6(0.635,2.772) 7(-0.635,2.772) 8(-1.905,2.772)
SOT-23-6_L2.9-W1.6-P0.95-LS2.8-BR
  rect 1.1x0.6 smd: 1(1.35,-0.95) 2(1.35,0) 3(1.35,0.95) 4(-1.35,0.95) 5(-1.35,0) 6(-1.35,-0.95)
Test-Point-0.5mm
  round 1 smd: 1(0,0)
TESTPOINT-SMD_BD2.0_C9900030651
  round 2 smd: 1(0,0)

## Nets
As in the schematic, except:
SPKP1: CN2.1 SPKP1.1
SPKP2: CN2.2 SPKN1.1

Pads without a net: FPC1 4 6 8 9 20 21 28; FPC3 16 20 21; U1 3 4

## Via types
v1: diameter 0.508, hole 0.305, Top Layer to Bottom Layer, 140 vias

## Routing (per net, layer and track width the routed paths; a pad name or vN(x,y) marks a point on that pad's centre or on a via; arc(x,y) is an arc through that point)
GND: length 242.9
  Top Layer w0.305: FPC3.4 36.39,19.87 v1(36.45,19.93) 36.45,38.66 28.32,46.79 28.32,60.44 v1(28.7,60.82) ; v1(26.58,62.13) 26.58,45.29 34.8,37.07 v1(34.8,19.93) 34.89,19.84 FPC3.7 ; FPC3.10 33.4,18.46 v1(33.4,17.39) ; 38.1,60.87 FPC1.13 36.5,60.87 36.29,60.66 v1(36.1,60.66) ; v1(28.83,17.39) 28.89,17.45 FPC3.19 ; 37.97,63.87 FPC1.23 v1(36.32,63.87) ; FPC1.7 38.1,59.07 ; FPC1.19 37.97,62.67 ; FPC4.4 33.6,52.12 v1(33.78,51.93) ; FPC3.23 v1(26.89,17.39) ; v1(29.97,17.39) 29.89,17.47 FPC3.17 ; v1(30.42,59.11) 30.42,48.82 37.85,41.39 v1(37.85,19.93) 37.89,19.88 FPC3.1 ; U1.5 v1(15.37,43.42) ; FPC1.22 33.61,63.57 v1(33.02,62.98) ; FPC1.32 38.1,56.62 ; FPC1.10 33.02,59.97 ; FPC3.13 v1(31.89,17.39) ; v1(33.4,19.93) 33.4,36.31 25.15,44.57 25.15,61.71 v1(24.38,62.47) ; FPC1.16 33.02,61.77 ; FPC3.15 v1(30.89,17.39)
  Top Layer w0.508: U5.2 v1(17.4,33.27) ; R8.1 v1(19.05,31.36) ; R9.1 v1(23.11,31.36) ; C2.1 v1(10.92,35.93) ; R10.1 v1(24.38,40.76)
  Bottom Layer w0.305: v1(36.1,60.66) 28.86,60.66 v1(28.7,60.82) ; v1(36.07,58.28) 35.73,58.28 35.62,58.17 33,58.17 31.62,59.55 30.86,59.55 v1(30.42,59.11) ; v1(24.38,63.36) 25.31,64.28 35.91,64.28 v1(36.32,63.87) ; v1(33.02,62.98) 28.7,62.98 27.96,62.24 26.69,62.24 v1(26.58,62.13) ; 24.6,62.26 v1(24.38,62.47)
  vias: v1(1.02,65.9) v1(1.02,60.82) v1(1.02,55.74) v1(1.02,50.66) v1(1.02,30.34) v1(1.02,25.26) v1(1.02,20.18) v1(1.02,15.1) v1(1.02,4.94) v1(6.1,65.9) v1(6.1,60.82) v1(6.1,55.74) v1(6.1,50.66) v1(6.1,45.58) v1(6.1,40.5) v1(11.18,70.98) v1(11.18,65.9) v1(11.18,60.82) v1(11.18,55.74) v1(11.18,20.18) v1(11.18,15.1) v1(11.18,10.02) v1(11.18,4.94) v1(16.26,70.98) v1(16.26,65.9) v1(16.26,60.82) v1(16.26,55.74) v1(16.26,20.18) v1(16.26,15.1) v1(16.26,10.02) v1(16.26,4.94) v1(21.34,70.98) v1(21.34,65.9) v1(21.34,60.82) v1(21.34,55.74) v1(21.34,25.26) v1(21.34,20.18) v1(21.34,15.1) v1(21.34,10.02) v1(21.34,4.94) v1(26.42,70.98) v1(26.42,15.1) v1(26.42,10.02) v1(26.42,4.94) v1(31.5,70.98) v1(31.5,35.42) v1(31.5,30.34) v1(31.5,25.26) v1(31.5,15.1) v1(31.5,10.02) v1(31.5,4.94) v1(36.58,55.74) v1(36.58,45.58) v1(36.58,15.1) v1(36.58,10.02) v1(36.58,4.94) v1(39.5,52.19) v1(41.66,65.9) v1(41.66,60.82) v1(41.66,55.74) v1(41.66,45.58) v1(41.66,40.5) v1(41.66,35.42) v1(41.66,30.34) v1(41.66,25.26) v1(41.66,20.18) v1(41.66,15.1) v1(41.66,10.02) v1(41.66,4.94)
VCC_3V3: length 124
  Top Layer w0.305: 31.39,19.58 31.74,19.93 ; 31.39,19.58 31.04,19.93 ; 31.39,19.58 31.39,19.89 31.35,19.93 ; 31.39,19.58 FPC3.14 ; 32.33,19.93 32.39,19.87 FPC3.12 ; FPC1.1 36.55,57.27 36.25,57.57 ; TP2.1 16.35,21.68 15.28,21.68 14.96,21.36 FPC2.6 ; FPC3.11 32.89,19.68 32.64,19.93 ; v1(31.12,54.09) 33.15,54.09 33.66,53.58 33.66,52.95 33.33,52.62 FPC4.5 ; FPC1.3 36.55,57.87 36.25,57.57 ; 36.25,57.57 FPC1.2 33.53,57.57
  Top Layer w0.381: 11.68,41.77 16.13,41.77 17.14,40.76 R7.2 ; v1(31.12,54.09) 31.12,56.5 32.19,57.57 33.53,57.57
  Top Layer w0.457: TP2.1 17.4,23.86 16.51,24.75 13.08,24.75 10.8,27.03 L1.1
  Top Layer w0.508: v1(10.92,30.6) 10.92,28.69 L1.1 ; v1(10.92,30.6) v1(16.76,30.6) ; v1(10.92,30.6) C2.2 10.99,32.32 U5.6 ; v1(28.45,30.6) 28.45,20.44 28.96,19.93 32.64,19.93 ; v1(20.7,48.76) 12.95,48.76 11.56,47.36 U1.8 11.56,41.64 v1(10.16,40.25)
  Bottom Layer w0.508: v1(10.16,40.25) 10.16,31.36 v1(10.92,30.6) ; v1(31.12,54.09) 21.46,54.09 20.7,53.33 v1(20.7,48.76) ; v1(16.76,30.6) v1(28.45,30.6)
BACK_LED+: length 32.7
  Top Layer w0.305: R1.1 21.34,47.1 v1(21.34,45.96) ; v1(26.39,40.76) FPC3.24
  Bottom Layer w0.305: v1(21.34,45.96) 24.64,45.96 26.39,44.21 v1(26.39,40.76)
BACK_LED-: length 30.5
  Top Layer w0.305: FPC3.22 27.39,40.93 26.03,42.28 21.72,42.28 21.35,42.64 R2.1
GP7101_LCD_BL: length 12
  Top Layer w0.158: R5.1 20.89,37.46 19.74,36.31 17.02,36.31 14.93,34.22 U5.4 ; R7.1 20.89,39.42 21.23,39.08 R6.1
I2C1_SCL_TP: length 56
  Top Layer w0.158: U1.1 9.42,39.52 9.4,39.49 ; 9.4,39.49 9.4,46.85 12.95,50.41 v1(21.72,50.41) ; 9.4,39.49 9.4,27.42 12.83,23.99 13.97,23.99 14.45,23.51 TP6.1 13.96,22.23 FPC2.4 ; v1(31.12,50.41) 31.33,50.62 FPC4.1
  Bottom Layer w0.158: v1(31.12,50.41) v1(21.72,50.41)
I2C1_SDA_TP: length 59.5
  Top Layer w0.158: FPC4.2 v1(31.12,51.12) ; v1(21.72,51.12) 12.78,51.12 8.76,47.11 v1(8.76,41.14) 8.76,27.29 12.98,23.08 TP5.1 12.98,22.1 13.46,21.62 FPC2.3 ; 12.83,39.52 v1(12.83,41.14)
  Bottom Layer w0.158: v1(8.76,41.14) v1(12.83,41.14) ; v1(31.12,51.12) v1(21.72,51.12)
I2C_DSI_VCC_LED+: length 41.9
  Top Layer w0.305: v1(18.29,31.36) 18.29,29.29 19.01,28.57 C1.2 21.24,27.55 21.75,27.04 24.89,27.04 25.27,27.42 25.27,40.63 v1(25.15,40.76) ; v1(16.76,31.36) 15.49,31.36 15.11,31.74 15.11,32.88 14.72,33.27 U5.5 ; R3.1 18.92,47.09 v1(18.92,45.96)
  Bottom Layer w0.305: v1(25.15,40.76) 25.15,44.44 24.38,45.2 19.69,45.2 v1(18.92,45.96) ; v1(16.76,31.36) v1(18.29,31.36)
I2C_DSI_VCC_LED-: length 17.3
  Top Layer w0.305: v1(18.42,42.66) 18.42,43.17 18.89,43.65 R4.1
  Top Layer w0.381: 17.45,34.22 18.91,34.22 R8.2 R9.2 ; 17.45,34.22 17.4,34.27 v1(17.4,35.04) ; 17.45,34.22 U5.3
  Bottom Layer w0.305: v1(17.4,35.04) 17.65,35.04 18.42,35.8 v1(18.42,42.66)
MIPI_DSI_0N: length 60.5
  Top Layer w0.117: v1(36.07,59.81) 36.07,59.97 36.37,60.27 FPC1.11 ; v1(29.72,59.55) 29.5,59.33 29.5,58.85 arc(29.55,58.73) 29.67,58.68 arc(29.79,58.63) 29.84,58.51 ; FPC3.2 37.39,19.24 37.3,19.33 37.3,39.4 36.35,40.35 arc(36.3,40.47) 36.35,40.6 36.38,40.63 arc(36.38,41.33) 35.68,41.33 35.64,41.3 arc(35.39,41.3) 35.39,41.55 35.42,41.59 arc(35.42,42.29) 34.72,42.29 34.69,42.26 arc(34.44,42.26) 34.44,42.51 34.47,42.54 arc(34.47,43.25) 33.76,43.25 33.73,43.21 arc(33.48,43.21) 33.48,43.47 33.51,43.5 arc(33.51,44.2) 32.81,44.2 32.78,44.17 arc(32.53,44.17) 32.53,44.42 32.56,44.45 arc(32.56,45.16) 31.85,45.16 31.82,45.13 arc(31.57,45.13) 31.57,45.38 31.6,45.41 arc(31.6,46.11) 30.9,46.11 30.87,46.08 arc(30.62,46.08) 30.62,46.33 30.65,46.36 arc(30.65,47.07) 29.94,47.07 29.91,47.04 arc(29.79,46.99) 29.66,47.04 29.5,47.2 29.5,57.45 arc(29.55,57.58) 29.67,57.63 arc(29.79,57.68) 29.84,57.8 ; 29.5,58.15 arc(29.55,58.03) 29.67,57.98 arc(29.79,57.93) 29.84,57.8 ; 29.84,58.5 arc(29.79,58.38) 29.67,58.33 arc(29.55,58.28) 29.5,58.15
  Bottom Layer w0.117: v1(36.07,59.81) 35.97,59.81 35.58,59.41 35.58,59.02 35.15,58.59 33.47,58.59 32.09,59.98 30.14,59.98 v1(29.72,59.55)
MIPI_DSI_0P: length 60.4
  Top Layer w0.117: v1(28.96,59.55) 29.18,59.33 29.18,47.07 29.43,46.81 arc(29.79,46.66) 30.14,46.81 30.17,46.84 arc(30.42,46.84) 30.42,46.59 30.39,46.56 arc(30.39,45.85) 31.09,45.85 31.12,45.89 arc(31.38,45.89) 31.38,45.63 31.34,45.6 arc(31.34,44.9) 32.05,44.9 32.08,44.93 arc(32.33,44.93) 32.33,44.68 32.3,44.65 arc(32.3,43.94) 33,43.94 33.04,43.97 arc(33.29,43.97) 33.29,43.72 33.26,43.69 arc(33.26,42.99) 33.96,42.99 33.99,43.02 arc(34.24,43.02) 34.24,42.77 34.21,42.74 arc(34.21,42.03) 34.92,42.03 34.95,42.06 arc(35.2,42.06) 35.2,41.81 35.17,41.78 arc(35.17,41.08) 35.87,41.08 35.9,41.11 arc(36.15,41.11) 36.15,40.86 36.12,40.83 arc(35.98,40.47) 36.12,40.12 36.98,39.27 36.98,19.33 36.89,19.24 FPC3.3 ; FPC1.12 35.18,60.57 35.57,60.19 35.57,60.06 v1(35.31,59.8)
  Bottom Layer w0.117: 35.31,59.8 35.31,59.13 35.04,58.86 33.59,58.86 32.2,60.25 29.65,60.25 v1(28.96,59.55)
MIPI_DSI_1N: length 61.4
  Top Layer w0.117: v1(36.07,62.6) 36.59,62.07 FPC1.17 ; FPC3.8 34.39,19.24 34.3,19.33 34.3,36.68 25.94,45.04 25.94,63.14 v1(26.16,63.36)
  Bottom Layer w0.117: v1(36.07,62.6) 35.85,62.82 35.85,63.38 35.36,63.87 28.45,63.87 27.47,62.89 26.33,62.89 26.2,63.02 26.2,63.33 v1(26.16,63.36)
MIPI_DSI_1P: length 61.4
  Top Layer w0.117: v1(35.31,62.6) 35.08,62.37 FPC1.18 ; FPC3.9 33.89,19.24 33.98,19.33 33.98,36.55 25.62,44.91 25.62,63.14 v1(25.4,63.36)
  Bottom Layer w0.117: v1(25.4,63.36) 25.87,62.89 25.88,62.89 26.15,62.62 27.58,62.62 28.56,63.6 35.25,63.6 35.58,63.27 35.58,62.87 v1(35.31,62.6)
MIPI_DSI_CLKN: length 61.6
  Top Layer w0.117: v1(35.31,61.33) 35.15,61.17 FPC1.14 ; FPC3.5 35.89,19.24 35.8,19.33 35.8,37.47 34.98,38.28 arc(34.94,38.38) 34.98,38.48 arc(35.12,38.8) 34.98,39.12 34.92,39.18 arc(34.6,39.31) 34.28,39.18 arc(34.18,39.14) 34.09,39.18 34.03,39.24 arc(33.99,39.34) 34.03,39.43 arc(34.16,39.75) 34.03,40.08 33.97,40.14 arc(33.65,40.27) 33.32,40.14 arc(33.23,40.1) 33.13,40.14 33.07,40.2 arc(33.03,40.29) 33.07,40.39 arc(33.21,40.71) 33.07,41.03 33.01,41.09 arc(32.69,41.23) 32.37,41.09 arc(32.27,41.05) 32.18,41.09 32.12,41.15 arc(32.08,41.25) 32.12,41.34 arc(32.25,41.67) 32.12,41.99 32.06,42.05 arc(31.74,42.18) 31.41,42.05 arc(31.32,42.01) 31.22,42.05 31.16,42.11 arc(31.12,42.2) 31.16,42.3 arc(31.3,42.62) 31.16,42.94 31.1,43 arc(30.78,43.14) 30.46,43 arc(30.36,42.96) 30.27,43 30.21,43.06 arc(30.17,43.16) 30.21,43.25 arc(30.34,43.58) 30.21,43.9 30.15,43.96 arc(29.82,44.09) 29.5,43.96 arc(29.41,43.92) 29.31,43.96 29.25,44.02 arc(29.21,44.11) 29.25,44.21 arc(29.38,44.53) 29.25,44.85 29.19,44.91 arc(28.87,45.05) 28.55,44.91 arc(28.45,44.87) 28.35,44.91 27.72,45.55 27.72,61.11 v1(27.94,61.33)
  Bottom Layer w0.117: v1(35.31,61.33) 35.31,61.49 35.19,61.61 34.16,61.61 arc(34.04,61.56) 33.99,61.43 33.99,61.42 arc(33.81,61.24) 33.64,61.42 33.64,61.43 arc(33.46,61.61) 33.29,61.43 33.29,61.42 arc(33.11,61.24) 32.94,61.42 32.94,61.43 arc(32.76,61.61) 32.58,61.43 32.58,61.42 arc(32.41,61.24) 32.23,61.42 32.23,61.43 arc(32.06,61.61) 31.88,61.43 31.88,61.42 arc(31.71,61.24) 31.53,61.42 31.53,61.43 arc(31.48,61.56) 31.36,61.61 28.22,61.61 v1(27.94,61.33)
MIPI_DSI_CLKP: length 61.6
  Top Layer w0.117: v1(36.07,61.33) 36.21,61.47 FPC1.15 ; FPC3.6 35.39,19.24 35.48,19.33 35.48,37.34 34.76,38.06 arc(34.62,38.38) 34.76,38.7 arc(34.8,38.8) 34.76,38.9 34.7,38.95 arc(34.6,38.99) 34.51,38.95 arc(34.18,38.82) 33.86,38.95 33.8,39.01 arc(33.67,39.34) 33.8,39.66 arc(33.84,39.75) 33.8,39.85 33.74,39.91 arc(33.65,39.95) 33.55,39.91 arc(33.23,39.78) 32.91,39.91 32.85,39.97 arc(32.71,40.29) 32.85,40.61 arc(32.89,40.71) 32.85,40.81 32.79,40.87 arc(32.69,40.91) 32.59,40.87 arc(32.27,40.73) 31.95,40.87 31.89,40.92 arc(31.76,41.25) 31.89,41.57 arc(31.93,41.67) 31.89,41.76 31.83,41.82 arc(31.74,41.86) 31.64,41.82 arc(31.32,41.69) 30.99,41.82 30.94,41.88 arc(30.8,42.2) 30.94,42.52 arc(30.97,42.62) 30.94,42.72 30.88,42.78 arc(30.78,42.82) 30.68,42.78 arc(30.36,42.64) 30.04,42.78 29.98,42.84 arc(29.85,43.16) 29.98,43.48 arc(30.02,43.58) 29.98,43.67 29.92,43.73 arc(29.82,43.77) 29.73,43.73 arc(29.41,43.6) 29.08,43.73 29.02,43.79 arc(28.89,44.11) 29.02,44.44 arc(29.06,44.53) 29.02,44.63 28.97,44.69 arc(28.87,44.73) 28.77,44.69 arc(28.45,44.55) 28.13,44.69 27.4,45.42 27.4,61.11 v1(27.18,61.33)
  Bottom Layer w0.117: v1(36.07,61.33) 35.96,61.33 35.42,61.88 27.83,61.88 27.28,61.33 v1(27.18,61.33)
MIPI_DSI_RESET: length 56.1
  Top Layer w0.158: FPC3.18 29.39,17.21 29.84,16.75 37.85,16.75 40.89,19.8 40.89,57.65 40.07,58.47 FPC1.5
MIPI_DSI_VCC_LED+: length 34
  Top Layer w0.305: FPC1.29 36.06,65.67 35.76,65.97 ; 35.76,65.97 FPC1.30 24.89,65.97 22.73,63.81 22.73,60.85 23.35,60.23 R1.2 ; 35.76,65.97 36.06,66.27 FPC1.31
MIPI_DSI_VCC_LED-: length 39
  Top Layer w0.305: FPC1.25 36.04,64.47 35.74,64.17 FPC1.24 33.6,64.17 33.38,64.4 33.38,64.77 ; R2.2 23.35,44.06 24.51,45.22 24.51,60.77 23.68,61.6 23.68,63.66 24.79,64.77 33.38,64.77 ; 33.38,64.77 FPC1.26 35.58,64.77 35.88,65.07 FPC1.27
SPKP1: length 47.7
  Top Layer w0.158: 3.31,4.91 3.31,3.76 3.6,3.47 5.01,3.47 5.97,4.43 8,4.43 9.65,6.08 9.65,11.16 6.48,14.34 6.48,35.59 arc(6.3,36.5) 5.78,37.27 SPKP1.1
SPKP2: length 40.7
  Top Layer w0.158: 4.56,4.91 7.33,4.91 8.89,6.47 8.89,10.91 5.59,14.21 5.59,33.65 arc(5.35,34.85) 4.67,35.87 SPKN1.1
TP_INT_A: length 60
  Top Layer w0.158: v1(31.12,51.8) 31.3,51.62 FPC4.3 ; v1(21.72,51.8) 12.06,51.8 8.13,47.87 8.13,27.17 v1(11.43,23.86) ; v1(15.93,23.86) TP4.1 15.26,22.06 14.89,22.06 14.46,21.63 FPC2.5
  Bottom Layer w0.158: v1(31.12,51.8) v1(21.72,51.8) ; v1(11.43,23.86) v1(15.93,23.86)
TP_RST: length 61.1
  Top Layer w0.158: FPC2.2 12.96,21.4 12.65,21.71 11.94,21.71 11.51,22.14 TP1.1 7.37,26.86 7.37,48.5 11.43,52.57 21.16,52.57 v1(21.72,53.12) ; FPC4.6 v1(31.12,53.12)
  Bottom Layer w0.158: v1(34.54,53.2) 34.46,53.12 v1(31.12,53.12) v1(21.72,53.12)
$1N1316: length 8.9
  Top Layer w0.158: L1.2 D1.2 16.39,28.57 16.41,28.56 17.15,28.56 17.65,29.07 17.65,31.87 17.2,32.32 U5.1
$1N3740: length 5.8
  Top Layer w0.158: v1(2.67,50.28) 2.67,49.86 arc(2.33,48.17) MIC1.1
  Bottom Layer w0.158: v1(2.67,52.19) v1(2.67,50.28)
$1N14217: length 19.5
  Top Layer w0.158: v1(17.4,35.8) 21.57,35.8 23.23,37.46 R6.2 ; U1.6 14.1,42.91 14.35,42.66 v1(17.4,42.66)
  Bottom Layer w0.158: v1(17.4,42.66) 17.91,42.15 17.91,36.31 v1(17.4,35.8)
$1N14397: length 13
  Top Layer w0.158: v1(17.4,41.9) 17.02,42.28 13.46,42.28 12.83,42.91 12.83,45.06 ; R5.2 v1(17.4,37.58)
  Bottom Layer w0.158: v1(17.4,41.9) v1(17.4,37.58)

## Copper pours and planes (outline as drawn; the poured copper is in the pictures)
GND on Top Layer: 0,75.3 43.44,75.3 43.44,0 0,0
GND on Bottom Layer: 0,75.3 43.44,75.3 43.44,0 0,0

Small or netless copper shapes (teardrops, artwork), in the pictures only: 160 on Top Layer, 48 on Bottom Layer

## Text on the board
Bottom Silkscreen Layer: 卖板不赚钱 | 广告位招租
Top Solder Mask Layer: 【V1.0.2】
Top Silkscreen Layer: TP | 31PIN MIPI | RST | 3V3 | INT | GND | SDA | SCL | 泰 / 山 / 派 | MIC | SKP | SKN | + | - | 背光选择 | 板载 | FPC | 3.1寸触摸屏 | 3.1寸MIPI屏 | 以培养中国工程师为己任 | 不靠卖板赚钱 | 3.1寸屏幕扩展板 | 立创开发板
